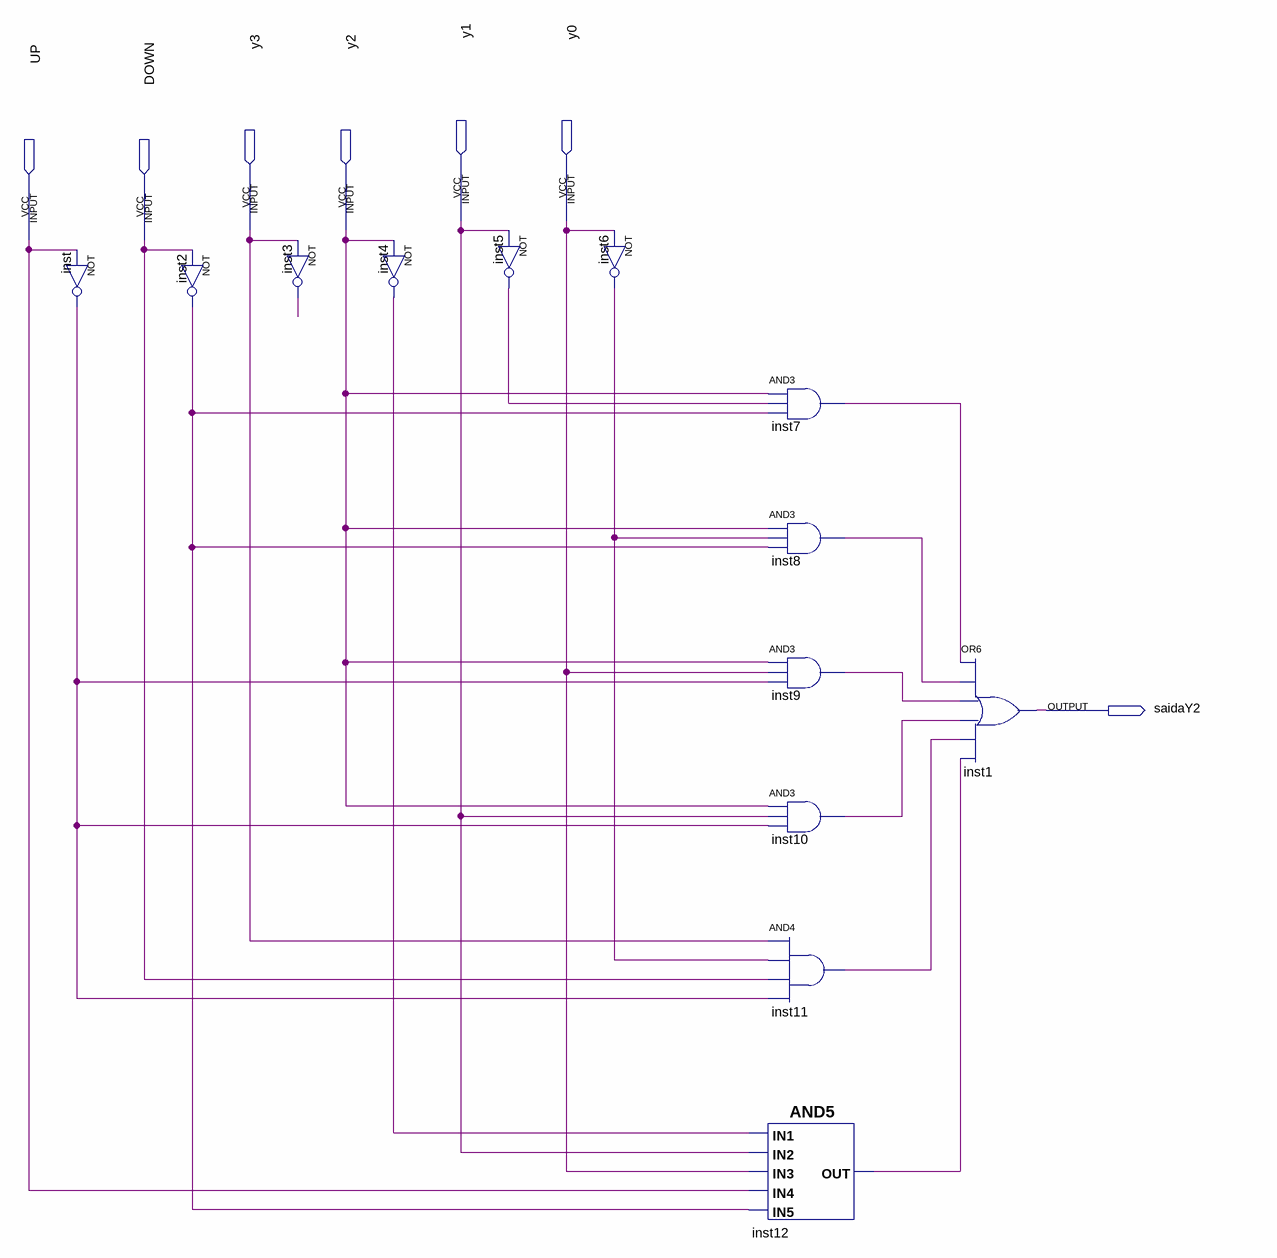
[diagram p0: schematic sheet]
// Quartus schematic Y2.bdf as structural Verilog: 13 symbols, 7 pins
module Y2 (
  input  y1,
  input  y0,
  input  y3,
  input  y2,
  input  UP,
  input  DOWN,
  output saidaY2
);

  wire inst2_out, inst3_out, inst4_out, inst5_out, inst6_out, inst7_out, inst8_out, inst9_out, inst10_out,
       inst11_out, inst12_out, inst_out;

  not inst (inst_out, UP);
  not inst2 (inst2_out, DOWN);
  not inst3 (inst3_out, y3);
  not inst4 (inst4_out, y2);
  not inst5 (inst5_out, y1);
  not inst6 (inst6_out, y0);
  and inst7 (inst7_out, y2, inst5_out, inst2_out);
  and inst8 (inst8_out, y2, inst6_out, inst2_out);
  and inst9 (inst9_out, y2, y0, inst_out);
  and inst10 (inst10_out, y2, y1, inst_out);
  and inst11 (inst11_out, y3, inst6_out, DOWN, inst_out);
  and inst12 (inst12_out, inst4_out, y1, y0, UP, inst2_out);
  or inst1 (saidaY2, inst7_out, inst8_out, inst9_out, inst10_out, inst11_out, inst12_out);
endmodule
